# EAGLE board MainECU rev10 (EAGLE 9.6.2), part 1 of 2
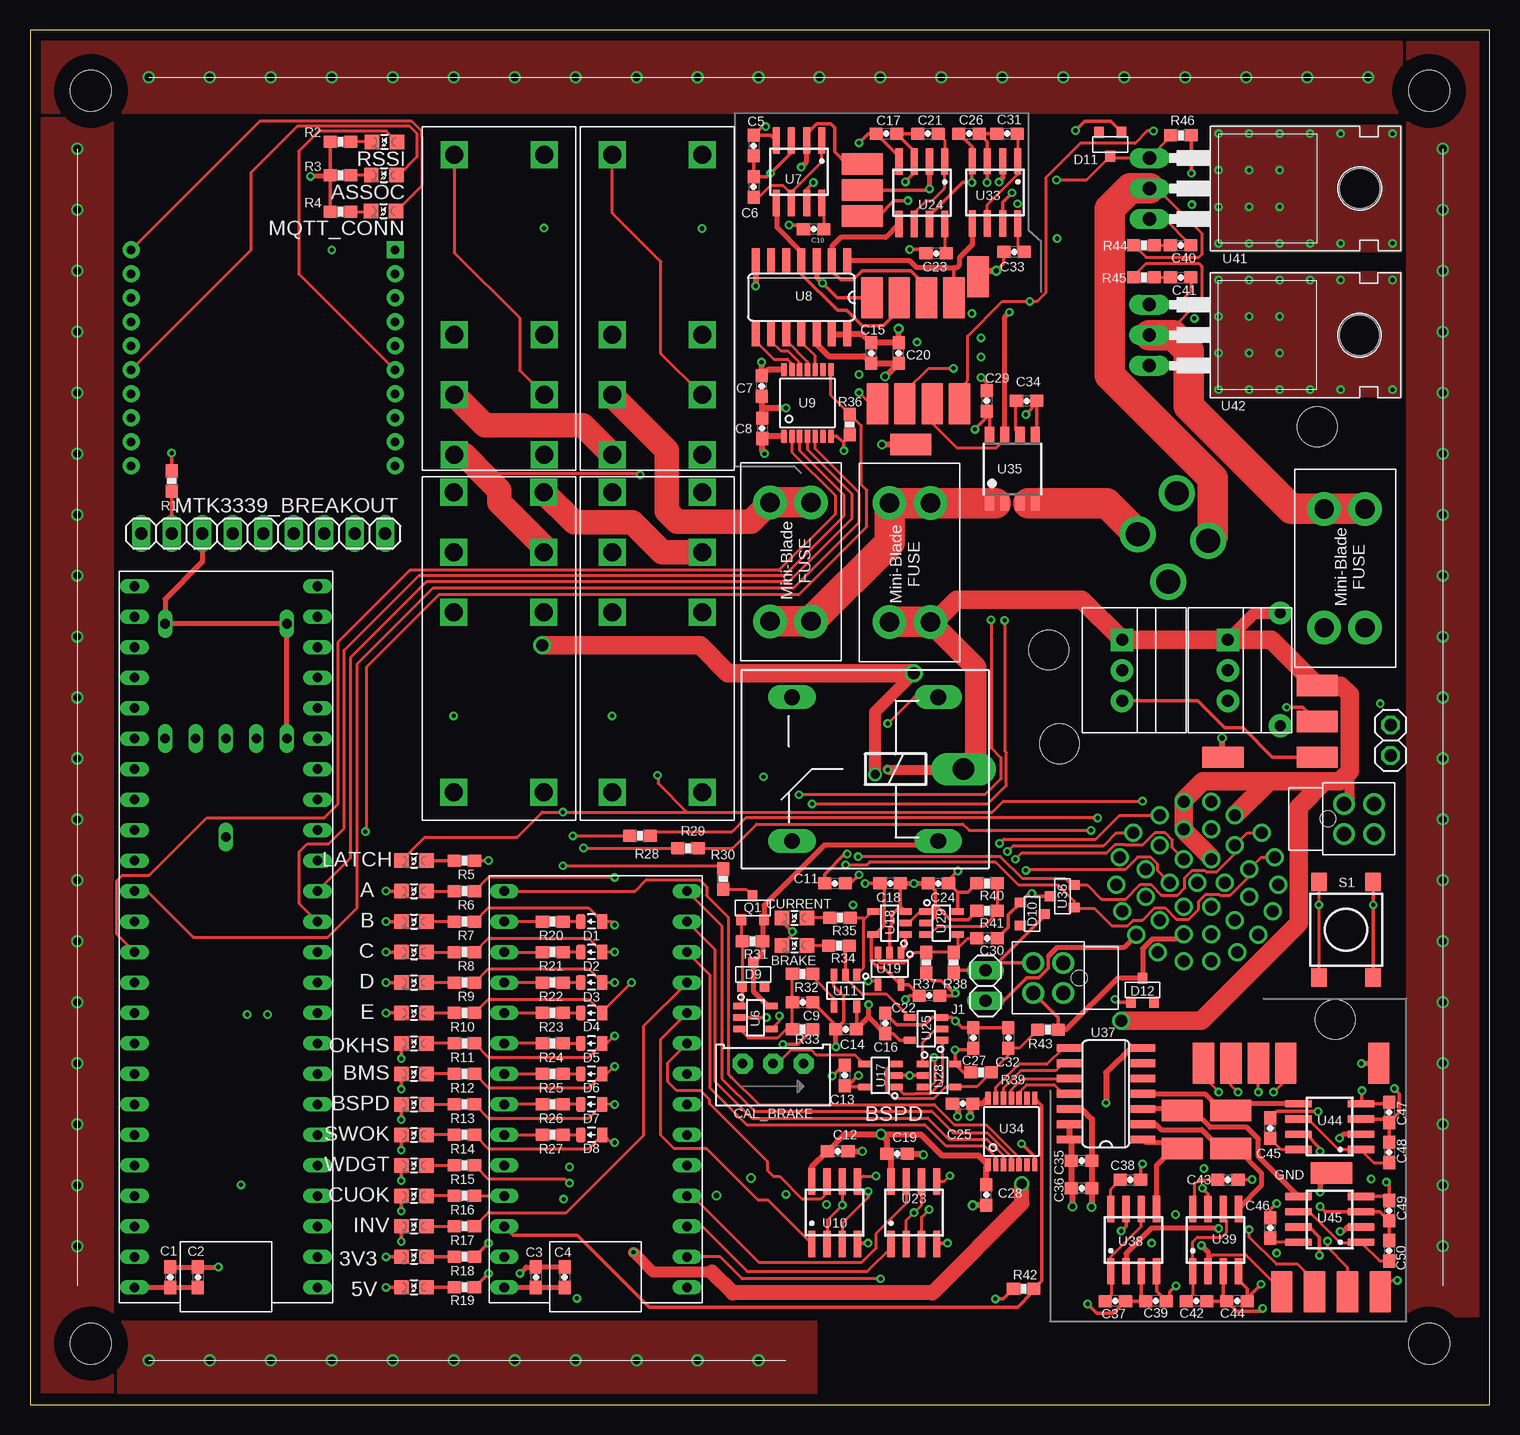
[diagram p4: board, top side]
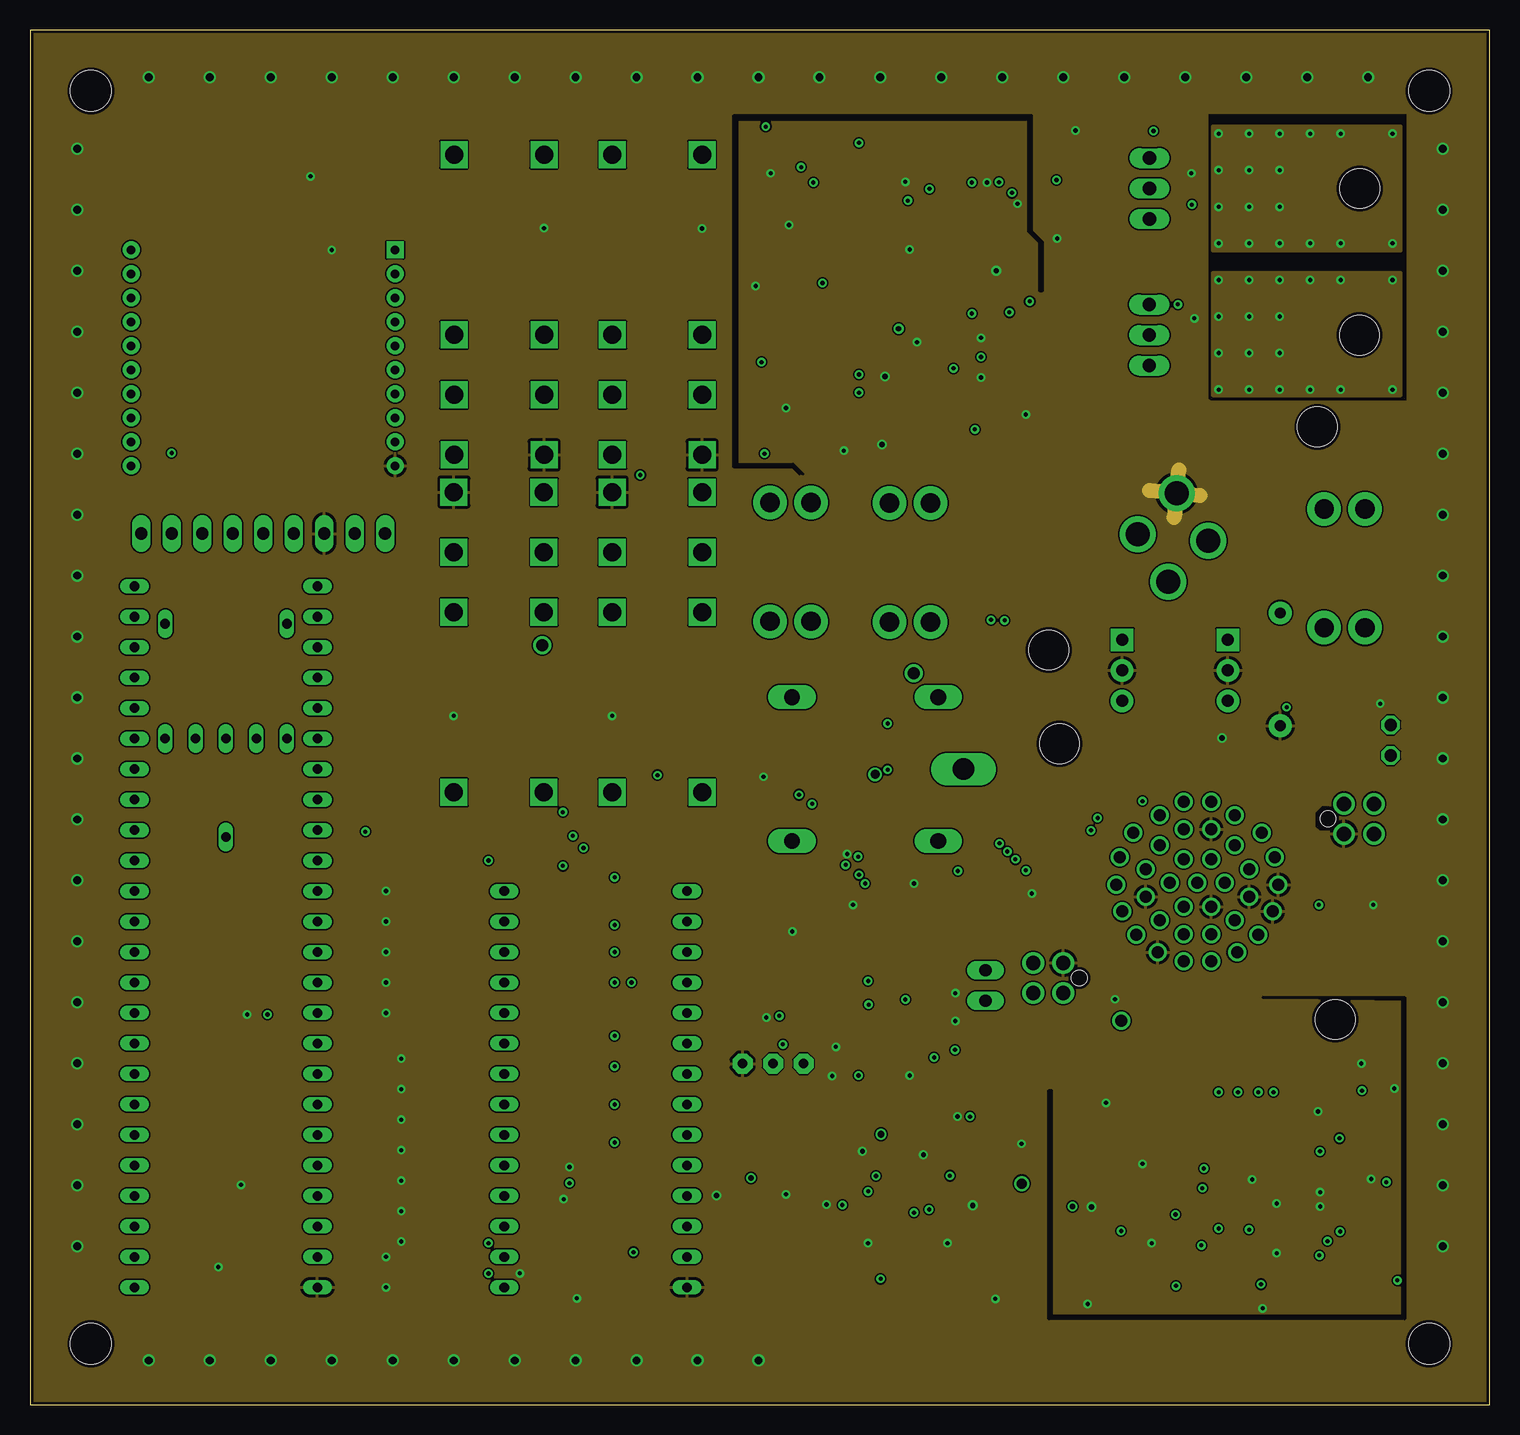
[diagram p5: board, inner layer Route2]
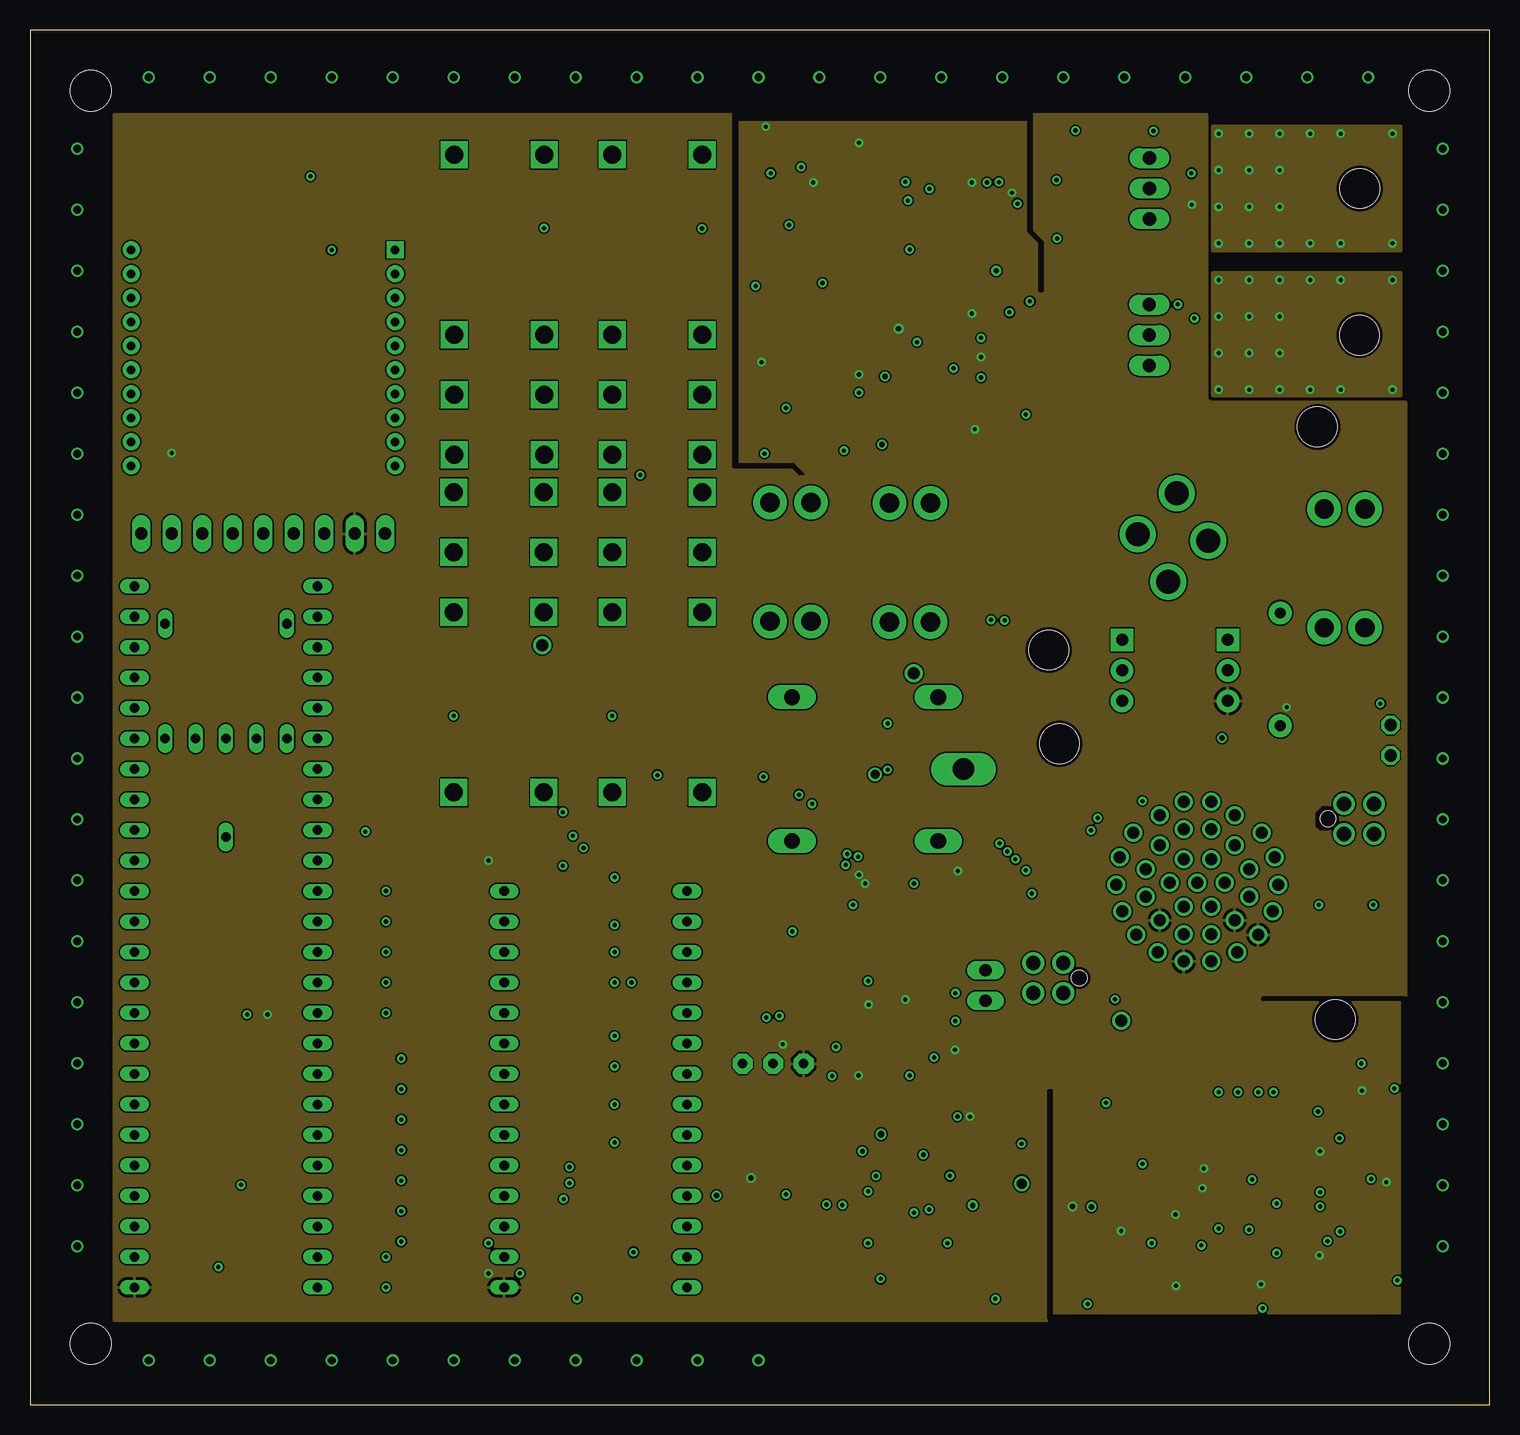
[diagram p6: board, inner layer Route15]
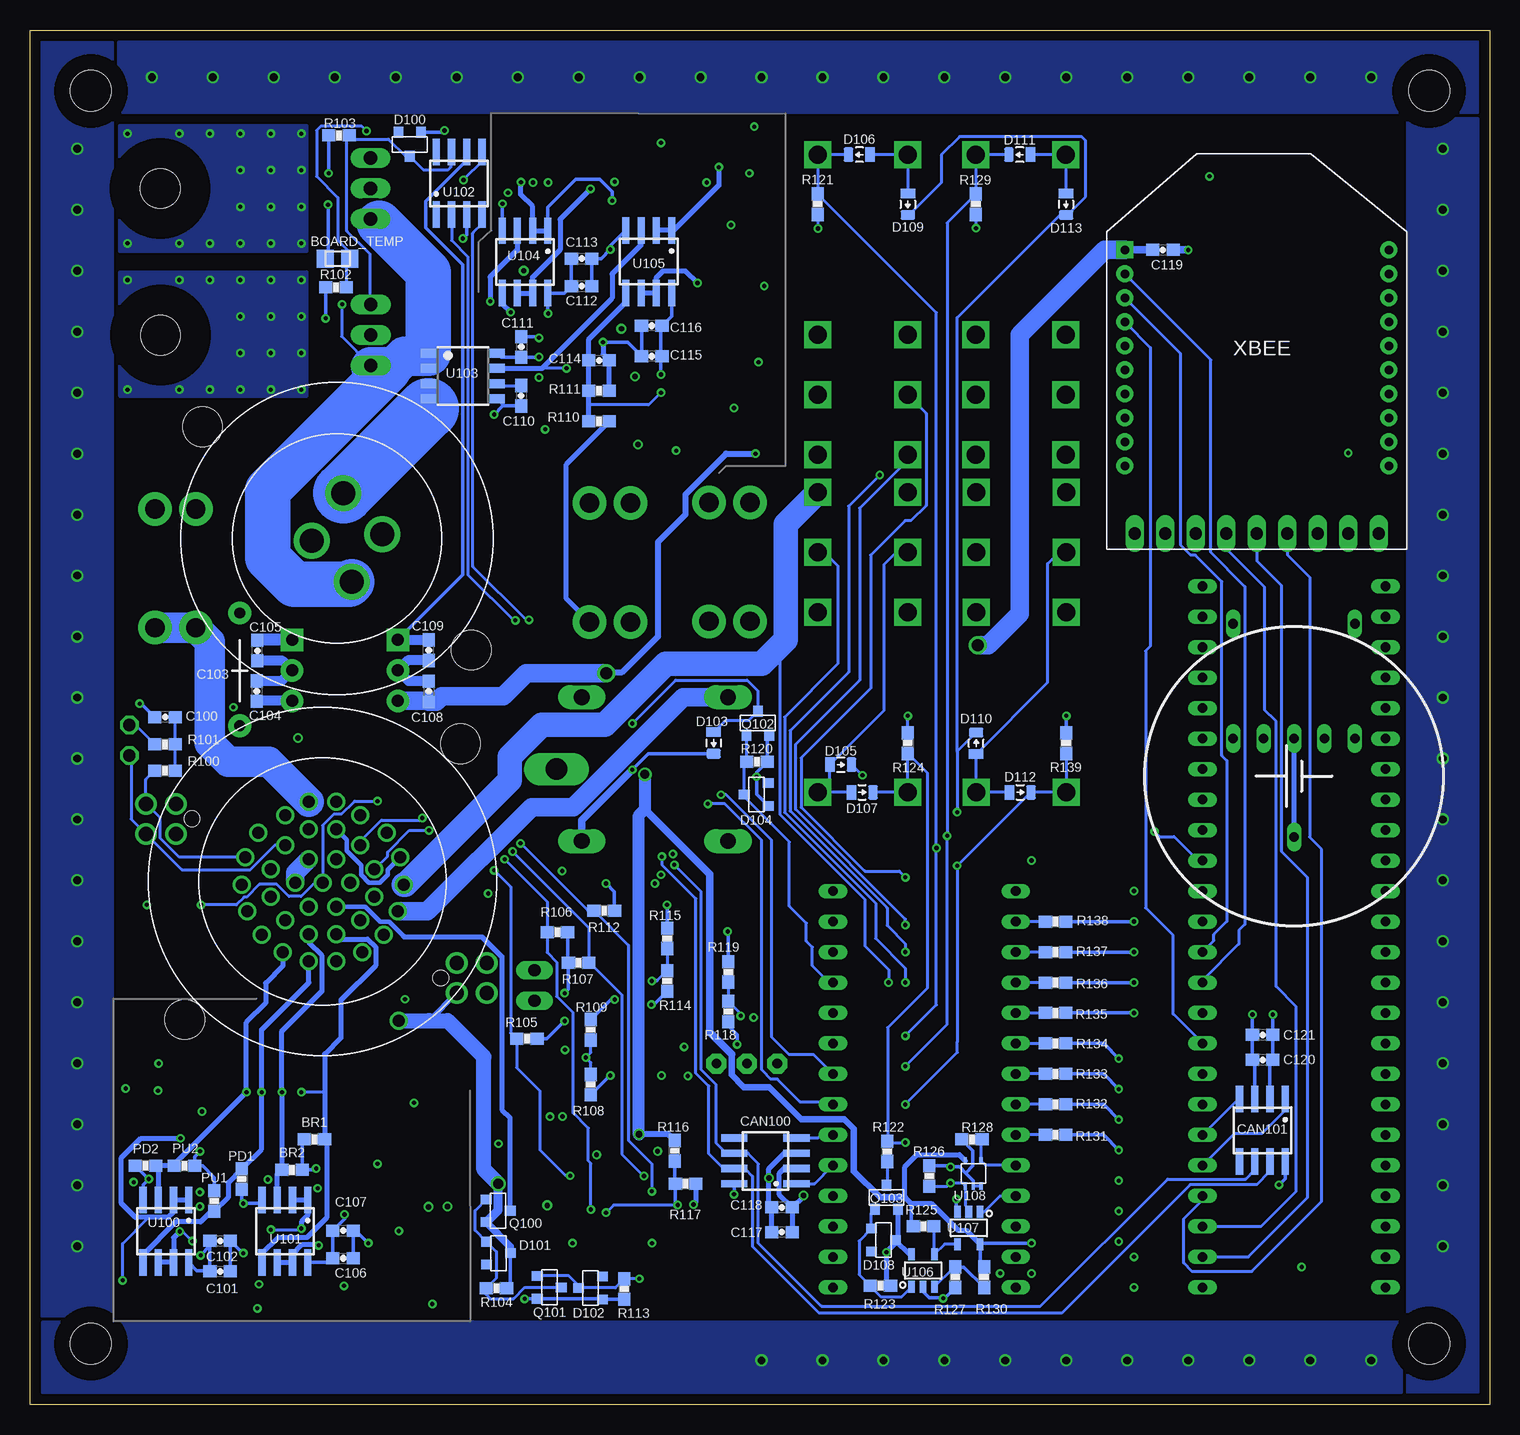
[diagram p7: board, bottom side, seen from below]

Size 121.67 x 114.55 mm. Coordinates in mm from the lower left corner, seen from the top.
Outline: 0,0 121.67,0 121.67,114.55 0,114.55 0,0
Copper layers (1+2*15+16): Top 0.035mm / dielectric 0.22mm / Route2 0.035mm / dielectric 39mil / Route15 0.035mm / dielectric 0.22mm / Bottom 0.035mm
Design rules "Advanced Circuits (4 Layer)": minimum track width 5mil, minimum drill 10mil, track to track 5mil, track to pad 5mil, pad to pad 5mil, via to via 5mil, smd to smd 5mil, copper to edge 10mil, drill to drill 6mil, minimum pad ring 7mil, minimum via ring 7mil, stop-mask expansion 2.5mil, vias tented up to drill 30mil, thermal gap 10mil

## Footprints (pad centres in the part's own frame; a part is rotated, then mirrored left to right if it is on the bottom)
LED-805 = smd 1.2 x 1.2: A 0,-1.05; C 0,1.05
MICRO_MINIATURE = smd 3.429 x 1.778: P$1 0,0
MINI-BLADE_FUSE_HOLDER = drill 1.613 pad 2.794: L1 0,3.404; L2 0,0; R1 9.906,3.404; R2 9.906,0
0805 = smd 1.4 x 1.5: 1 -1.025,0; 2 1.025,0
0603-RES = smd 1.1 x 1: 1 -0.85,0; 2 0.85,0
0603-CAP = smd 1.1 x 1: 1 -0.85,0; 2 0.85,0
CAP-PTH-LARGE = drill 0.9 pad 1.905: 1 -4.826,0; 2 4.572,0
TRIMPOT_3296 = drill 0.813 pad 1.676 octagon: 1 2.54,1.27; 2 0,1.27; 3 -2.54,1.27
SOIC-08 = smd 0.6 x 2.2: 1 -1.905,-2.6; 2 -0.635,-2.6; 3 0.635,-2.6; 4 1.905,-2.6; 5 1.905,2.6; 6 0.635,2.6; 7 -0.635,2.6; 8 -1.905,2.6
1X02_SLIM = drill 1.016 octagon: 1 -1.27,0; 2 1.27,0
0805_D = smd 0.8 x 1.2: A -0.9,0; C 0.9,0
SOT23 = smd 0.8 x 0.9: 1 -0.95,-1; 2 0.95,-1; 3 0,1
RELAY_DPDT = drill 1.5 square: 2 10.008,0; 3 5.004,0; 4 0,0; 5 0,7.493; 6 5.004,7.493; 7 10.008,7.493; COIL+ 25.019,0; COIL- 25.019,7.493
ZF112 = drill 1.321 long: 1 4.064,14.884; 2 4.064,2.896; O 16.256,14.884; S 16.256,2.896 | drill 1.803 long: P 1.956,8.89
1X02 = drill 1.016 long: 1 -1.27,0; 2 1.27,0
1X09 = drill 1.016 long: 1 -8.89,0; 2 -6.35,0; 3 -3.81,0; 4 -1.27,0; 5 1.27,0; 6 3.81,0; 7 6.35,0; 8 8.89,0; 9 11.43,0
OKI-78SR = drill 1 pad 1.88 square: 1 -2.54,0 | drill 1 pad 1.88: 2 0,0; 3 2.54,0
TACTILE_SWITCH_SMD_6.2MM_TALL = smd 1.55 x 1.3: A1 -3.975,-2.25; A2 3.975,-2.25; B1 -3.975,2.25; B2 3.975,2.25
TEENSY_3.5_EXT = drill 0.8 long: 3.3V 16.51,54.61; 3.3V_1 1.27,24.13; 3.3V_2 6.35,13.97; A0 16.51,29.21; A1 16.51,31.75; A2 16.51,34.29; A3 16.51,36.83; A4 16.51,39.37; A5 16.51,41.91; A6 16.51,44.45; A7 16.51,46.99; A8 16.51,49.53; A9 16.51,52.07; A12 1.27,3.81; A13 1.27,1.27; A14 16.51,1.27; A15 16.51,3.81; A16 16.51,6.35; A17 16.51,8.89; A18 16.51,11.43; A19 16.51,13.97; A20 16.51,16.51; A21 16.51,19.05; A22 16.51,21.59; AGND 16.51,57.15; D0(RX1) 1.27,57.15; D1(TX1) 1.27,54.61; D2 1.27,52.07; D3(CANTX) 1.27,49.53; D4(CANRX) 1.27,46.99; D5 1.27,44.45; D6 1.27,41.91; D7(RX3) 1.27,39.37; D8(TX3) 1.27,36.83; D9(RX2) 1.27,34.29; D10(TX2) 1.27,31.75; D11 1.27,29.21; D12 1.27,26.67; D13 16.51,26.67; D24 1.27,21.59; D25 1.27,19.05; D26 1.27,16.51; D27 1.27,13.97; D28 1.27,11.43; D29 1.27,8.89; D30 1.27,6.35; GND 1.27,59.69; GND_1 16.51,24.13; GND_2 8.89,13.97; PROG 11.43,13.97; RST 13.97,13.97; VBAT 3.81,13.97; VIN 16.51,59.69
TEENSY_3.2_SIMPLE = drill 0.8 long: 3.3V 16.51,29.21; A0 16.51,3.81; A1 16.51,6.35; A2 16.51,8.89; A3 16.51,11.43; A4 16.51,13.97; A5 16.51,16.51; A6 16.51,19.05; A7 16.51,21.59; A8 16.51,24.13; A9 16.51,26.67; AGND 16.51,31.75; D0(RX1) 1.27,31.75; D1(TX1) 1.27,29.21; D2 1.27,26.67; D3(CANTX) 1.27,24.13; D4(CANRX) 1.27,21.59; D5 1.27,19.05; D6 1.27,16.51; D7(RX3) 1.27,13.97; D8(TX3) 1.27,11.43; D9(RX2) 1.27,8.89; D10(TX2) 1.27,6.35; D11 1.27,3.81; D12 1.27,1.27; D13 16.51,1.27; GND 1.27,34.29; VIN 16.51,34.29
SOT-23-5 = smd 1 x 0.55: 1 -1.35,0.95; 2 -1.35,0; 3 -1.35,-0.95; 4 1.35,-0.95; 5 1.35,0.95
SO14 = smd 0.66 x 2.032: 1 -3.81,-3.073; 2 -2.54,-3.073; 3 -1.27,-3.073; 4 0,-3.073; 5 1.27,-3.073; 6 2.54,-3.073; 7 3.81,-3.073; 8 3.81,3.073; 9 2.54,3.073; 10 1.27,3.073; 11 0,3.073; 12 -1.27,3.073; 13 -2.54,3.073; 14 -3.81,3.073
TSSOP-14 = smd 0.45 x 1.1: 1 -1.958,-2.618; 2 -1.308,-2.618; 3 -0.657,-2.618; 4 -0.007,-2.618; 5 0.642,-2.618; 6 1.292,-2.618; 7 1.942,-2.618; 8 1.942,2.918; 9 1.292,2.918; 10 0.642,2.918; 11 -0.007,2.918; 12 -0.657,2.918; 13 -1.308,2.918; 14 -1.958,2.918
SOP8 = smd 0.76 x 1.27: 1 -1.905,-2.86; 2 -0.635,-2.86; 3 0.635,-2.86; 4 1.905,-2.86; 5 1.905,2.86; 6 0.635,2.86; 7 -0.635,2.86; 8 -1.905,2.86
TO-220-H-HOLE = drill 1.118 long: 1 -2.54,-6.35; 2 0,-6.35; 3 2.54,-6.35 | hole 3.302: 0,11.176
SOT323-5 = smd 0.61 x 0.254: EN -2.108,0; GND -2.108,0.635; VCC 0,1.295; WDI 0,0; WDO -2.108,1.295
CR-2450/G1AN = drill 0.8 long: +_0 -5.08,12.7; +_1 5.08,12.7; - 0,-5.08
M3_MOUNTING = hole 3.4: 0,0
NANO-FIT_VERTICAL-4 = drill 1.2: P$1 -1.25,0; P$2 1.25,0; P$3 -1.25,2.5; P$4 1.25,2.5 | hole 1.3: 0,-1.34
AUTOSPORT_14-35 = drill 1: P$1 1.143,6.655; P$2 3.124,5.512; P$3 5.359,4.064; P$4 6.452,2.032; P$5 6.756,-0.254; P$6 6.274,-2.489; P$7 5.08,-4.445; P$8 3.302,-5.893; P$9 1.143,-6.655; P$10 -1.143,-6.655; P$11 -3.302,-5.893; P$12 -5.08,-4.445; P$13 -6.274,-2.489; P$14 -6.756,-0.254; P$15 -6.452,2.032; P$16 -5.359,4.064; P$17 -3.124,5.512; P$18 -1.143,6.655; P$19 1.143,4.369; P$20 3.124,3.023; P$21 4.318,1.016; P$22 4.318,-1.27; P$23 3.124,-3.226; P$24 1.143,-4.369; P$25 -1.143,-4.369; P$26 -3.124,-3.226; P$27 -4.318,-1.27; P$28 -4.318,1.016; P$29 -3.124,3.023; P$30 -1.143,4.369; P$31 1.143,1.88; P$32 2.286,-0.102; P$33 1.143,-2.083; P$34 -1.143,-2.083; P$35 -2.286,-0.102; P$36 -1.143,1.88; P$37 0,-0.102 | hole 3.3: -11.491,-11.491; 11.491,11.491
AUTOSPORT_12-04 = drill 2: P$1 0,3.81; P$2 3.708,0.889; P$3 0,-2.108; P$4 -3.708,0.889 | hole 3.3: -10.288,-10.288; 10.288,10.288
XBEE = drill 0.7 pad 1.422 square: 1 -11,5.5 | drill 0.7 pad 1.422: 2 -11,3.5; 3 -11,1.5; 4 -11,-0.5; 5 -11,-2.5; 6 -11,-4.5; 7 -11,-6.5; 8 -11,-8.5; 9 -11,-10.5; 10 -11,-12.5; 11 11,-12.5; 12 11,-10.5; 13 11,-8.5; 14 11,-6.5; 15 11,-4.5; 16 11,-2.5; 17 11,-0.5; 18 11,1.5; 19 11,3.5; 20 11,5.5

## Placement (x,y rotation side)
3V3  Blue  [LED-805]  32,12.32 90 top
3V3_TEST  TEST_POINTMICRO_MINIATURE  [MICRO_MINIATURE]  107.26,53.95 180 top
5ABOARDFUSE1  5A  [MINI-BLADE_FUSE_HOLDER]  71.63,75.13 270 top
5AFUSE1  5A  [MINI-BLADE_FUSE_HOLDER]  111.25,64.74 90 top
5ASHUTDOWNFUSE1  5A  [MINI-BLADE_FUSE_HOLDER]  65.07,65.28 90 top
5V  Blue  [LED-805]  32,9.78 90 top
12V_TEST  12V_TEST  [MICRO_MINIATURE]  107.26,59.92 180 top
A  Blue  [LED-805]  32,42.8 90 top
ACCEL1_BUFF_TEST  12V_TEST  [MICRO_MINIATURE]  112.52,9.4 90 top
ACCEL2_BUFF_TEST  TEST_POINTMICRO_MINIATURE  [MICRO_MINIATURE]  109.78,9.4 90 top
ASSOC  Red  [LED-805]  29.49,102.46 90 top
B  Green  [LED-805]  32,40.26 90 top
BMS  Yellow  [LED-805]  32,27.56 90 top
BOARD_TEMP  THERMISTOR_NCP210805  [0805]  96.04,95.5 0 bottom
BR1  10k  [0603-RES]  97.97,22.1 180 bottom
BR2  10k  [0603-RES]  99.82,19.56 0 bottom
BRAKE  Red  [LED-805]  63.7,38.28 90 top
BRAKE1_BUFF_TEST  TEST_POINTMICRO_MINIATURE  [MICRO_MINIATURE]  107.05,9.4 270 top
BRAKE2_BUFF_TEST  TEST_POINTMICRO_MINIATURE  [MICRO_MINIATURE]  104.31,9.4 90 top
BSPD  Orange  [LED-805]  32,25.02 90 top
C  Yellow  [LED-805]  32,37.72 90 top
C1  0.1uF  [0603-CAP]  11.68,10.62 270 top
C2  1uF  [0603-CAP]  14,10.62 270 top
C3  0.1uF  [0603-CAP]  42.16,10.62 270 top
C4  1uF  [0603-CAP]  44.55,10.62 270 top
C5  0.1uF  [0603-CAP]  60.3,104.93 270 top
C6  0.1uF  [0603-CAP]  60.3,101.47 270 top
C7  0.1uF  [0603-CAP]  60.99,84.89 90 top
C8  0.1uF  [0603-CAP]  61.01,81.36 270 top
C9  0.47uF  [0603-CAP]  64.39,33.53 0 top
C10  470pF  [0603-CAP]  65.3,97.97 180 top
C11  0.1uF  [0603-CAP]  67.08,43.43 0 top
C12  0.1uF  [0603-CAP]  67.31,21.12 180 top
C13  0.1uF  [0603-CAP]  67.89,27.43 270 top
C14  0.1uF  [0603-CAP]  68,31.29 0 top
C15  0.1uF  [0603-CAP]  70.1,87.63 90 top
C16  0.1uF  [0603-CAP]  71.27,31.78 270 top
C17  0.1uF  [0603-CAP]  71.37,105.92 0 top
C18  0.1uF  [0603-CAP]  71.68,43.43 180 top
C19  0.1uF  [0603-CAP]  72.26,20.9 180 top
C20  1uF  [0603-CAP]  72.39,87.63 90 top
C21  0.1uF  [0603-CAP]  74.83,105.92 0 top
C22  0.1uF  [0603-CAP]  74.96,34.09 180 top
C23  470pF  [0603-CAP]  75.51,95.94 180 top
C24  0.1uF  [0603-CAP]  75.69,43.43 0 top
C25  0.1uF  [0603-CAP]  77.72,25.1 0 top
C26  0.1uF  [0603-CAP]  78.26,105.92 0 top
C27  0.1uF  [0603-CAP]  78.61,30.56 270 top
C28  0.1uF  [0603-CAP]  79.71,17.48 90 top
C29  0.1uF  [0603-CAP]  79.73,83.64 270 top
C30  15nF  [0603-CAP]  79.76,38.86 180 top
C31  0.1uF  [0603-CAP]  81.43,105.92 0 top
C32  2.2uF  [0603-CAP]  81.53,30.56 270 top
C33  470pF  [0603-CAP]  82.02,96.06 180 top
C34  47nF  [0603-CAP]  83.06,83.64 0 top
C35  1uF  [0603-CAP]  87.63,20.32 180 top
C36  0.1uF  [0603-CAP]  87.63,18.03 180 top
C37  0.1uF  [0603-CAP]  90.45,8.64 180 top
C38  470pF  [0603-CAP]  91.69,18.75 0 top
C39  0.1uF  [0603-CAP]  93.83,8.64 180 top
C40  [0603-CAP]  95.89,96.62 0 top
C41  [0603-CAP]  95.89,93.93 0 top
C42  0.1uF  [0603-CAP]  97.21,8.64 180 top
C43  470pF  [0603-CAP]  99.82,18.75 0 top
C44  0.1uF  [0603-CAP]  100.58,8.64 180 top
C45  470pF  [0603-CAP]  103.35,23.04 90 top
C46  470pF  [0603-CAP]  103.35,14.73 90 top
C47  0.1uF  [0603-CAP]  113.26,24.36 270 top
C48  0.1uF  [0603-CAP]  113.26,21.02 270 top
C49  0.1uF  [0603-CAP]  113.26,16.16 270 top
C50  0.1uF  [0603-CAP]  113.26,12.83 270 top
C100  4.7nF  [0603-CAP]  110.41,57.3 180 bottom
C101  1uF  [0603-CAP]  105.82,11.1 0 bottom
C102  0.1uF  [0603-CAP]  105.82,13.64 0 bottom
C103  470uF  [CAP-PTH-LARGE]  104.19,61.15 270 bottom
C104  10uF  [0603-CAP]  102.77,59.46 270 bottom
C105  10uF  [0603-CAP]  102.72,62.84 90 bottom
C106  0.1uF  [0603-CAP]  95.58,12.19 0 bottom
C107  1uF  [0603-CAP]  95.58,14.5 0 bottom
C108  10uF  [0603-CAP]  88.44,59.44 270 bottom
C109  10uF  [0603-CAP]  88.44,62.86 90 bottom
C110  47nF  [0603-CAP]  80.75,84.07 270 bottom
C111  0.1uF  [0603-CAP]  80.72,88.14 270 bottom
C112  1uF  [0603-CAP]  75.69,93.22 0 bottom
C113  0.1uF  [0603-CAP]  75.69,95.5 0 bottom
C114  1uF  [0603-CAP]  74.24,87.02 0 bottom
C115  0.1uF  [0603-CAP]  69.85,87.38 180 bottom
C116  1uF  [0603-CAP]  69.85,89.92 180 bottom
C117  0.1uF  [0603-CAP]  59,14.38 180 bottom
C118  1uF  [0603-CAP]  59,16.43 180 bottom
C119  0.1uF  [0603-CAP]  27.25,96.23 0 bottom
C120  1uF  [0603-CAP]  18.95,28.73 180 bottom
C121  0.1uF  [0603-CAP]  18.95,30.81 180 bottom
CAL_BRAKE  [TRIMPOT_3296]  61.93,27.15 0 top
CAN100  MCP2551  [SOIC-08]  60.38,20.32 90 bottom
CAN101  MCP2551  [SOIC-08]  18.97,22.86 180 bottom
CAN_TERM_JMP1  M02_SLIM  [1X02_SLIM]  113.39,55.37 90 top
CUOK  Red  [LED-805]  32,17.4 90 top
CURRENT  Yellow  [LED-805]  63.7,40.56 90 top
D  Orange  [LED-805]  32,35.18 90 top
D1  TS4148 RYG  [0805_D]  46.79,40.26 180 top
D2  TS4148 RYG  [0805_D]  46.79,37.72 180 top
D3  TS4148 RYG  [0805_D]  46.79,35.18 180 top
D4  TS4148 RYG  [0805_D]  46.79,32.64 180 top
D5  TS4148 RYG  [0805_D]  46.79,30.1 180 top
D6  TS4148 RYG  [0805_D]  46.79,27.56 180 top
D7  TS4148 RYG  [0805_D]  46.79,25.02 180 top
D8  TS4148 RYG  [0805_D]  46.79,22.48 180 top
D9  MMBZ5246BLT1G  [SOT23]  60.27,35.84 0 top
D10  MMBZ5246BLT1G  [SOT23]  83.52,40.89 270 top
D11  MMBZ5246BLT1G  [SOT23]  90.02,105.03 180 top
D12  MMBZ5246BLT1G  [SOT23]  92.71,34.54 0 top
D100  MMBZ5246BLT1G  [SOT23]  90.02,105.03 180 bottom
D101  MMBZ5246BLT1G  [SOT23]  82.63,12.62 270 bottom
D102  MMBZ5246BLT1G  [SOT23]  74.96,9.73 90 bottom
D103  TS4148 RYG  [0805_D]  64.69,55.14 270 bottom
D104  MMBZ5246BLT1G  [SOT23]  61.14,50.85 90 bottom
D105  TS4148 RYG  [0805_D]  54.1,53.34 0 bottom
D106  TS4148 RYG  [0805_D]  52.55,104.17 180 bottom
D107  TS4148 RYG  [0805_D]  52.32,51.03 0 bottom
D108  MMBZ5246BLT1G  [SOT23]  50.55,13.72 270 bottom
D109  TS4148 RYG  [0805_D]  48.51,100.04 270 bottom
D110  TS4148 RYG  [0805_D]  42.82,55.12 90 bottom
D111  TS4148 RYG  [0805_D]  39.19,104.17 180 bottom
D112  TS4148 RYG  [0805_D]  39.14,51.03 0 bottom
D113  TS4148 RYG  [0805_D]  35.33,100.04 270 bottom
E  Red  [LED-805]  32,32.64 90 top
IMD_SHUTDOWN_RLY1  RT424009  [RELAY_DPDT]  56.02,79.15 90 top
INV  Red  [LED-805]  32,14.86 90 top
INVERTER_PWR_RELAY1  G5LE  [ZF112]  79.76,61.85 180 top
J1  JUMPER.1  [1X02]  79.63,34.92 90 top
LATCH  White  [LED-805]  32,45.34 90 top
MQTT_CONN  Blue  [LED-805]  29.46,99.47 90 top
MTK3339_BREAKOUT  MTK3339  [1X09]  20.7,72.59 180 top
OKHS  Green  [LED-805]  32,30.1 90 top
PD1  10k  [0603-RES]  104.01,18.8 270 bottom
PD2  10k  [0603-RES]  112.04,19.91 180 bottom
PU1  10k  [0603-RES]  106.3,16.97 90 bottom
PU2  10k  [0603-RES]  108.79,19.91 0 bottom
Q1  P-CHANNEL_MOSFET_DMP3099L-7  [SOT23]  60.22,41.4 0 top
Q100  P-CHANNEL_MOSFET_DMP3099L-7  [SOT23]  82.65,16.15 270 bottom
Q101  DMG3406L  [SOT23]  78.38,9.78 270 bottom
Q102  DMG3406L  [SOT23]  61.01,56.79 0 bottom
Q103  P-CHANNEL_MOSFET_DMP3099L-7  [SOT23]  50.29,17.27 0 bottom
R1  10k  [0603-RES]  11.81,76.96 270 top
R2  30  [0603-RES]  25.88,105.23 0 top
R3  147  [0603-RES]  25.88,102.46 0 top
R4  30  [0603-RES]  25.88,99.42 0 top
R5  200  [0603-RES]  36.2,45.34 180 top
R6  909  [0603-RES]  36.2,42.8 180 top
R7  909  [0603-RES]  36.2,40.26 180 top
R8  1k  [0603-RES]  36.2,37.72 180 top
R9  1k  [0603-RES]  36.2,35.18 180 top
R10  1k  [0603-RES]  36.2,32.64 180 top
R11  866  [0603-RES]  36.2,30.1 180 top
R12  976  [0603-RES]  36.2,27.56 180 top
R13  976  [0603-RES]  36.2,25.02 180 top
R14  976  [0603-RES]  36.2,22.48 180 top
R15  215  [0603-RES]  36.2,19.94 180 top
R16  147  [0603-RES]  36.2,17.4 180 top
R17  30.1  [0603-RES]  36.2,14.86 180 top
R18  30.1  [0603-RES]  36.2,12.32 180 top
R19  215  [0603-RES]  36.2,9.78 180 top
R20  43k  [0603-RES]  43.56,40.26 180 top
R21  43k  [0603-RES]  43.56,37.72 180 top
R22  43k  [0603-RES]  43.56,35.18 180 top
R23  43k  [0603-RES]  43.56,32.64 180 top
R24  43k  [0603-RES]  43.56,30.1 180 top
R25  43k  [0603-RES]  43.56,27.56 180 top
R26  43k  [0603-RES]  43.56,25.02 180 top
R27  43k  [0603-RES]  43.56,22.48 180 top
R28  68  [0603-RES]  50.84,47.4 0 top
R29  68  [0603-RES]  54.82,46.38 0 top
R30  68  [0603-RES]  57.76,43.79 90 top
R31  10k  [0603-RES]  60.2,38.61 180 top
R32  330  [0603-RES]  64.39,35.89 0 top
R33  680k  [0603-RES]  64.39,31.29 0 top
R34  324  [0603-RES]  67.41,38.25 180 top
R35  215  [0603-RES]  67.51,40.56 180 top
R36  10k  [0603-RES]  68.33,81.69 90 top
R37  10k  [0603-RES]  74.68,36.83 90 top
R38  14k  [0603-RES]  76.96,36.83 90 top
R39  100k  [0603-RES]  79.25,27.69 0 top
R40  10.2k  [0603-RES]  79.76,43.43 180 top
R41  1130  [0603-RES]  79.76,41.15 0 top
R42  10k  [0603-RES]  82.8,9.65 0 top
R43  100  [0603-RES]  84.84,31.24 180 top
R44  [0603-RES]  92.84,96.62 0 top
R45  [0603-RES]  92.84,93.93 0 top
R46  10k  [0603-RES]  95.91,105.77 180 top
R100  60.4  [0603-RES]  110.41,52.83 0 bottom
R101  60.4  [0603-RES]  110.41,55.02 180 bottom
R102  43k  [0603-RES]  96.16,93.12 0 bottom
R103  10k  [0603-RES]  95.91,105.77 0 bottom
R104  10k  [0603-RES]  82.8,9.7 180 bottom
R105  150  [0603-RES]  80.26,30.48 180 bottom
R106  150  [0603-RES]  77.72,39.37 180 bottom
R107  150  [0603-RES]  75.95,36.83 0 bottom
R108  1130  [0603-RES]  74.93,26.67 90 bottom
R109  10.2k  [0603-RES]  74.93,31.24 90 bottom
R110  43k  [0603-RES]  74.24,81.94 180 bottom
R111  12k  [0603-RES]  74.24,84.48 0 bottom
R112  150  [0603-RES]  73.81,41.15 180 bottom
R113  10k  [0603-RES]  72.14,9.63 90 bottom
R114  10700  [0603-RES]  68.58,35.31 270 bottom
R115  14300  [0603-RES]  68.58,38.86 270 bottom
R116  10k  [0603-RES]  67.94,21.16 90 bottom
R117  10k  [0603-RES]  67.03,18.4 180 bottom
R118  4.02k  [0603-RES]  63.47,32.77 270 bottom
R119  12k  [0603-RES]  63.47,36.07 270 bottom
R120  10k  [0603-RES]  61.09,53.57 0 bottom
R121  2k  [0603-RES]  56.01,100.04 90 bottom
R122  68  [0603-RES]  50.22,21.11 90 bottom
R123  10k  [0603-RES]  50.8,9.91 180 bottom
R124  2k  [0603-RES]  48.51,55.12 270 bottom
R125  10k  [0603-RES]  47.19,14.86 180 bottom
R126  10k  [0603-RES]  46.74,19.05 270 bottom
R127  10k  [0603-RES]  44.55,10.62 90 bottom
R128  10k  [0603-RES]  43.18,22.1 0 bottom
R129  2k  [0603-RES]  42.84,100.04 90 bottom
R130  10k  [0603-RES]  42.16,10.62 90 bottom
R131  12k  [0603-RES]  36.2,22.48 0 bottom
R132  12k  [0603-RES]  36.2,25.02 0 bottom
R133  12k  [0603-RES]  36.2,27.56 0 bottom
R134  12k  [0603-RES]  36.2,30.1 0 bottom
R135  12k  [0603-RES]  36.2,32.64 0 bottom
R136  12k  [0603-RES]  36.2,35.18 0 bottom
R137  12k  [0603-RES]  36.2,37.72 0 bottom
R138  12k  [0603-RES]  36.2,40.26 0 bottom
R139  2k  [0603-RES]  35.33,55.12 270 bottom
READ_ACCEL1_TEST  12V_TEST  [MICRO_MINIATURE]  100.08,24.51 180 top
READ_ACCEL2_TEST  TEST_POINTMICRO_MINIATURE  [MICRO_MINIATURE]  96.01,24.51 180 top
READ_BRAKE1_TEST  TEST_POINTMICRO_MINIATURE  [MICRO_MINIATURE]  96.01,21.34 180 top
READ_BRAKE2_TEST  TEST_POINTMICRO_MINIATURE  [MICRO_MINIATURE]  100.08,21.34 180 top
REG1  3.3V  [OKI-78SR]  91.01,61.19 270 top
REG2  5V  [OKI-78SR]  99.82,61.19 270 top
RSSI  Green  [LED-805]  29.54,105.23 90 top
S1  Switch  [TACTILE_SWITCH_SMD_6.2MM_TALL]  109.68,39.57 90 top
SIGNAL_ACCEL1_TEST  12V_TEST  [MICRO_MINIATURE]  104.65,28.45 270 top
SIGNAL_ACCEL2_TEST  TEST_POINTMICRO_MINIATURE  [MICRO_MINIATURE]  102.36,28.45 270 top
SIGNAL_BRAKE1_TEST  TEST_POINTMICRO_MINIATURE  [MICRO_MINIATURE]  100.08,28.45 270 top
SIGNAL_BRAKE2_TEST  TEST_POINTMICRO_MINIATURE  [MICRO_MINIATURE]  97.79,28.45 270 top
SIGNAL_GND  TEST_POINTMICRO_MINIATURE  [MICRO_MINIATURE]  112.39,28.45 270 top
SWOK  Red  [LED-805]  32,22.48 90 top
U1  TEENSY_3.5_EXT  [TEENSY_3.5_EXT]  25.22,69.47 180 top
U2  RT424009  [RELAY_DPDT]  35.33,76.05 270 top
U3  RT424009  [RELAY_DPDT]  42.84,79.15 90 top
U4  RT424009  [RELAY_DPDT]  48.51,76.05 270 top
U5  TEENSY_3.2_SIMPLE  [TEENSY_3.2_SIMPLE]  56.03,44.07 180 top
U6  OPA990IDBVR  [SOT-23-5]  60.45,32.26 0 top
U7  MAX7480  [SOIC-08]  64.08,102.74 180 top
U8  MCP3204  [SO14]  64.29,92.28 180 top
U9  TXB0104TSSOP  [TSSOP-14]  64.8,83.31 0 top
U10  LM293DG4  [SOIC-08]  67.06,16 0 top
U11  SN74AHC1G09  [SOT-23-5]  67.94,34.49 270 top
U12  TEST_POINTMICRO_MINIATURE  [MICRO_MINIATURE]  69.34,103.38 0 top
U13  TEST_POINTMICRO_MINIATURE  [MICRO_MINIATURE]  69.34,101.22 0 top
U14  TEST_POINTMICRO_MINIATURE  [MICRO_MINIATURE]  69.34,99.06 0 top
U15  TEST_POINTMICRO_MINIATURE  [MICRO_MINIATURE]  70.15,92.23 90 top
U16  TEST_POINTMICRO_MINIATURE  [MICRO_MINIATURE]  70.61,83.41 90 top
U17  OPA990IDBVR  [SOT-23-5]  70.87,27.43 180 top
U18  SN74LVC1G32  [SOT-23-5]  71.63,40.13 180 top
U19  OPA990IDBVR  [SOT-23-5]  71.63,36.32 270 top
U20  TEST_POINTMICRO_MINIATURE  [MICRO_MINIATURE]  72.43,92.23 90 top
U21  TEST_POINTMICRO_MINIATURE  [MICRO_MINIATURE]  72.9,83.41 90 top
U22  TEST_POINTMICRO_MINIATURE  [MICRO_MINIATURE]  73.41,80.01 180 top
U23  LM293DG4  [SOIC-08]  73.66,16 0 top
U24  MAX7480  [SOIC-08]  74.32,100.99 180 top
U25  SN74LVC1G32  [SOT-23-5]  74.68,31.32 180 top
U26  TEST_POINTMICRO_MINIATURE  [MICRO_MINIATURE]  74.71,92.23 90 top
U27  TEST_POINTMICRO_MINIATURE  [MICRO_MINIATURE]  75.18,83.41 90 top
U28  OPA990IDBVR  [SOT-23-5]  75.74,27.43 0 top
U29  OPA990IDBVR  [SOT-23-5]  75.95,40.13 0 top
U30  TEST_POINTMICRO_MINIATURE  [MICRO_MINIATURE]  76.99,92.23 90 top
U31  TEST_POINTMICRO_MINIATURE  [MICRO_MINIATURE]  77.47,83.41 90 top
U32  TEST_POINTMICRO_MINIATURE  [MICRO_MINIATURE]  78.99,93.98 90 top
U33  MAX7480  [SOIC-08]  80.42,101.02 180 top
U34  TXB0104TSSOP  [TSSOP-14]  81.79,22.61 0 top
U35  ACHS-7121  [SOP8]  81.86,77.98 0 top
U36  CDSOT23-T24CAN-Q  [SOT23]  86.03,42.37 90 top
U37  MCP3204  [SO14]  89.66,25.91 90 top
U38  MAX7480  [SOIC-08]  91.97,13.72 0 top
U39  MAX7480  [SOIC-08]  98.81,13.72 0 top
U40  TEST_POINTMICRO_MINIATURE  [MICRO_MINIATURE]  99.42,53.95 0 top
U41  N-CHANNEL_MOSFET_IRF1324PBF  [TO-220-H-HOLE]  99.64,101.35 270 top
U42  N-CHANNEL_MOSFET_IRF1324PBF  [TO-220-H-HOLE]  99.62,89.13 270 top
U43  TEST_POINTMICRO_MINIATURE  [MICRO_MINIATURE]  107.26,56.93 180 top
U44  MAX7480  [SOIC-08]  108.31,23.16 90 top
U45  MAX7480  [SOIC-08]  108.31,15.44 90 top
U46  TEST_POINTMICRO_MINIATURE  [MICRO_MINIATURE]  108.46,19.3 0 top
U100  MCP6002SOIC  [SOIC-08]  110.34,14.45 180 bottom
U101  MCP6002SOIC  [SOIC-08]  100.43,14.45 180 bottom
U102  MC34152  [SOIC-08]  85.9,101.78 0 bottom
U103  ACHS-7121  [SOP8]  85.6,85.73 270 bottom
U104  MCP6002SOIC  [SOIC-08]  80.42,95.22 180 bottom
U105  MCP6002SOIC  [SOIC-08]  70.1,95.25 180 bottom
U106  OPA990IDBVR  [SOT-23-5]  47.24,11.18 90 bottom
U107  SN74AHC1G09  [SOT-23-5]  43.43,14.73 270 bottom
U108  STWD100PYW83F  [SOT323-5]  42.42,20.32 90 bottom
U109  CR-2450/G1AN  [CR-2450/G1AN]  16.33,52.37 0 bottom
U$1  [M3_MOUNTING]  116.59,109.47 0 top
U$2  [M3_MOUNTING]  5.08,109.47 0 top
U$3  [M3_MOUNTING]  5.08,5.08 0 top
U$4  [M3_MOUNTING]  116.59,5.08 0 top
WDGT  Green  [LED-805]  32,19.94 90 top
X1  CONNECTOR-4NANO-FIT-VERTICAL-4  [NANO-FIT_VERTICAL-4]  86.11,35.56 90 top
X2  CONNECTOR-4NANO-FIT-VERTICAL-4  [NANO-FIT_VERTICAL-4]  109.5,48.82 270 top
X100  CONNECTOR-37  [AUTOSPORT_14-35]  97.28,43.59 0 bottom
X101  CONNECTOR-4AUTOSPORT  [AUTOSPORT_12-04]  96.09,72.19 275.3 bottom
XBEE  XBEE  [XBEE]  19.43,90.73 0 bottom